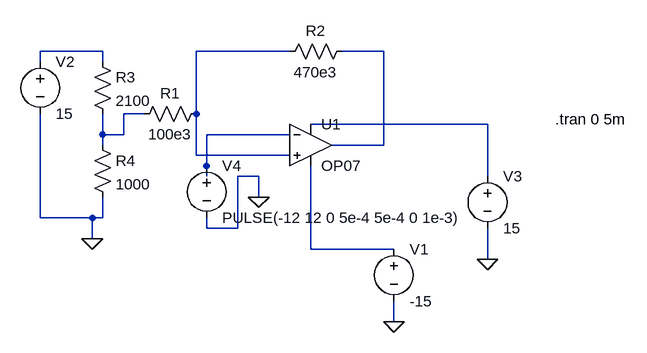
[diagram p0: schematic op-amphysterisis.asc]
op-amphysterisis.asc, the LTspice schematic file:
Version 4
SHEET 1 988 680
WIRE 160 176 64 176
WIRE 448 176 304 176
WIRE 592 176 528 176
WIRE 64 192 64 176
WIRE 160 192 160 176
WIRE 224 272 192 272
WIRE 304 272 304 176
WIRE 752 288 480 288
WIRE 160 304 160 272
WIRE 192 304 192 272
WIRE 192 304 160 304
WIRE 448 304 320 304
WIRE 160 320 160 304
WIRE 592 320 592 176
WIRE 592 320 512 320
WIRE 304 336 304 272
WIRE 448 336 304 336
WIRE 320 352 320 304
WIRE 320 368 320 352
WIRE 400 368 368 368
WIRE 752 368 752 288
WIRE 400 400 400 368
WIRE 64 432 64 272
WIRE 144 432 64 432
WIRE 160 432 160 400
WIRE 160 432 144 432
WIRE 320 448 320 432
WIRE 368 448 368 368
WIRE 368 448 320 448
WIRE 144 464 144 432
WIRE 480 480 480 352
WIRE 608 480 480 480
WIRE 752 496 752 448
WIRE 608 592 608 560
FLAG 144 464 0
FLAG 608 592 0
FLAG 752 496 0
FLAG 400 400 0
SYMBOL Res 320 256 R90
WINDOW 0 0 56 VBottom 2
WINDOW 3 32 56 VTop 2
SYMATTR InstName R1
SYMATTR Value 100e3
SYMBOL Res 544 160 R90
WINDOW 0 0 56 VBottom 2
WINDOW 3 32 56 VTop 2
SYMATTR InstName R2
SYMATTR Value 470e3
SYMBOL OpAmps/OP07 480 256 R0
SYMATTR InstName U1
SYMBOL Voltage 608 464 R0
SYMATTR InstName V1
SYMATTR Value -15
SYMBOL Voltage 752 352 R0
SYMATTR InstName V3
SYMATTR Value 15
SYMBOL Voltage 64 176 R0
SYMATTR InstName V2
SYMATTR Value 15
SYMBOL Voltage 320 336 R0
SYMATTR InstName V4
SYMATTR Value PULSE(-12 12 0 5e-4 5e-4 0 1e-3)
SYMBOL Res 144 176 R0
SYMATTR InstName R3
SYMATTR Value 2100
SYMBOL Res 144 304 R0
SYMATTR InstName R4
SYMATTR Value 1000
TEXT 856 280 Left 2 !.tran 0 5m

The netlist it stands for:
* op-amphysterisis.asc
R1 N002 N004 100e3
R2 N003 N002 470e3
XU1 N002 N006 N005 N007 N003 LT1001  ; OP07, pins In+ In- V+ V- OUT
V1 N007 0 -15
V3 N005 0 15
V2 N001 0 15
V4 N006 0 PULSE(-12 12 0 5e-4 5e-4 0 1e-3)
R3 N001 N004 2100
R4 N004 0 1000
.tran 0 5m
.lib LTC.lib
.backanno
.end